# Altium project Clock.PrjPCB
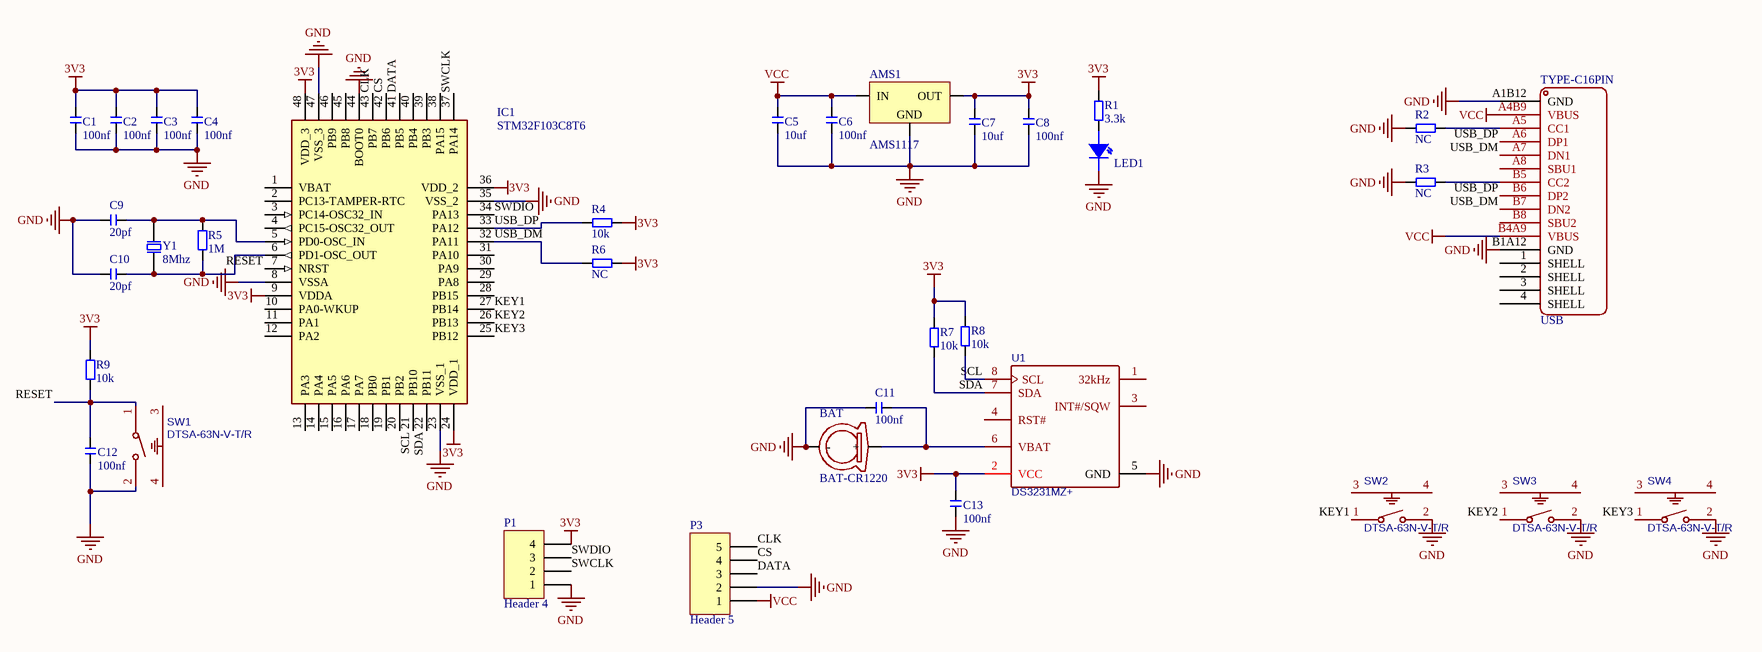
[diagram p0: Clocl.SchDoc]
1 sheet, 35 parts. Net scope: global (net labels, ports and power ports of the same name join across sheets).
Board file: Clock.PcbDoc

## Sheet Clocl.SchDoc
size A3

### Parts
AMS1  AMS1117  [SOT223]
BAT  BAT-CR1220  [BAT-CR1220]
C1  100nf  [C0805]
C2  100nf  [C0805]
C3  100nf  [C0805]
C4  100nf  [C0805]
C5  10uf  [C0805]
C6  100nf  [C0805]
C7  10uf  [C0805]
C8  100nf  [C0805]
C9  20pf  [C0805]
C10  20pf  [C0805]
C11  100nf  [C0805]
C12  100nf  [C0805]
C13  100nf  [C0805]
IC1  STM32F103C8T6  [QFP50P900X900X160-48N]
LED1  LED  [LED0603-Orange]  (value not drawn)
P1  Header 4  [HDR1X4]
P3  Header 5  [HDR1X5]
R1  3.3k  [R0805]
R2  NC  [R0805]
R3  NC  [R0805]
R4  10k  [R0805]
R5  1M  [R0805]
R6  NC  [R0805]
R7  10k  [R0805]
R8  10k  [R0805]
R9  10k  [R0805]
SW1  DTSA-63N-V-T/R  [SW-TH_DTSA-63N-V-T/R]
SW2  DTSA-63N-V-T/R  [SW-TH_DTSA-63N-V-T/R]
SW3  DTSA-63N-V-T/R  [SW-TH_DTSA-63N-V-T/R]
SW4  DTSA-63N-V-T/R  [SW-TH_DTSA-63N-V-T/R]
TYPE-C16PIN  USB  [USB3.0-TYPE-C-SMD_16PIN-H-PITCH0.50]
U1  DS3231MZ+  [SOIC-8_L4.9-W3.9-P1.27-LS6.0-BL]
Y1  8Mhz  [XTAL_49S-SMD]

### Nets
3V3: AMS1.2(OUT) C1.1 C2.1 C3.1 C4.1 C7.1 C8.1 C13.1 IC1.9(VDDA) IC1.24(VDD_1) IC1.36(VDD_2) IC1.48(VDD_3) P1.4 R1.2 R4.1 R6.1 R7.2 R8.2 R9.2 U1.2(VCC)
GND: AMS1.1(GND) BAT.2(-) C1.2 C2.2 C3.2 C4.2 C5.2 C6.2 C7.2 C8.2 C9.1 C10.1 C11.1 C12.2 C13.2 IC1.8(VSSA) IC1.23(VSS_1) IC1.35(VSS_2) IC1.44(BOOT0) IC1.47(VSS_3) LED1.2 P1.1 P3.2 R2.2 R3.2 SW1.2 SW2.2 SW3.2 SW4.2 TYPE-C16PIN.A1B12(GND) TYPE-C16PIN.B1A12(GND) U1.5(GND)
VCC: AMS1.3(IN) C5.1 C6.1 P3.1 TYPE-C16PIN.A4B9(VBUS) TYPE-C16PIN.B4A9(VBUS)
CLK: IC1.43(PB7) P3.5
CS: IC1.42(PB6) P3.4
DATA: IC1.41(PB5) P3.3
KEY1: IC1.27(PB14) SW2.1
KEY2: IC1.26(PB13) SW3.1
KEY3: IC1.25(PB12) SW4.1
RESET: C12.1 IC1.7(NRST) R9.1 SW1.1
SCL: IC1.21(PB10) R8.1 U1.8(SCL)
SDA: IC1.22(PB11) R7.1 U1.7(SDA)
SWCLK: IC1.37(PA14) P1.2
SWDIO: IC1.34(PA13) P1.3
USB_DM: IC1.32(PA11) R6.2 TYPE-C16PIN.A7(DN1) TYPE-C16PIN.B7(DN2)
USB_DP: IC1.33(PA12) R4.2 TYPE-C16PIN.A6(DP1) TYPE-C16PIN.B6(DP2)
NetBAT_1: BAT.1(+) C11.2 U1.6(VBAT)
NetC9_2: C9.2 IC1.5(PD0-OSC_IN) R5.2 Y1.2
NetC10_2: C10.2 IC1.6(PD1-OSC_OUT) R5.1 Y1.1
NetLED1_1: LED1.1 R1.1
NetR2_1: R2.1 TYPE-C16PIN.A5(CC1)
NetR3_1: R3.1 TYPE-C16PIN.B5(CC2)

Not connected (* = marked no-connect by the designer): IC1 1(VBAT) 2(PC13-TAMPER-RTC) 3(PC14-OSC32_IN) 4(PC15-OSC32_OUT) 10(PA0-WKUP) 11(PA1) 12(PA2) 13(PA3) 14(PA4) 15(PA5) 16(PA6) 17(PA7) 18(PB0) 19(PB1) 20(PB2) 28(PB15) 29(PA8) 30(PA9) 31(PA10) 38(PA15) 39(PB3) 40(PB4) 45(PB8) 46(PB9); SW1 3 4; SW2 3 4; SW3 3 4; SW4 3 4; TYPE-C16PIN 1(SHELL) 2(SHELL) 3(SHELL) 4(SHELL) A8(SBU1) B8(SBU2); U1 1(32kHz) 3(INT#/SQW) 4(RST#)

### Library data of the parts
AMS1 = AMS1117: Power
C1-C13 = CAP: 无极电容; accuracy: 20%
  C1-C4 C6 C8 C11-C13: value: 100nf
  C5 C7: value: 10uf
  C9 C10: value: 20pf
IC1 = STM32F103C8T6: Integrated Circuit; Manufacturer_Name: STMicroelectronics; Allied_Number: 70390993; Datasheet Link: http://www.st.com/st-web-ui/static/active/en/resource/technical/document/datasheet/CD00161566.pdf; Height: 1.6mm; Manufacturer_Part_Number: STM32F103C8T6; Mouser Part Number: 511-STM32F103C8T6; Mouser Price/Stock: https://www.mouser.com/Search/Refine.aspx?Keyword=511-STM32F103C8T6; RS Part Number: 0402279P; RS Price/Stock: http://uk.rs-online.com/web/p/products/0402279P; Allied Price/Stock: http://www.alliedelec.com/stmicroelectronics-stm32f103c8t6/70390993/
LED1 = LED: 发光二极管
P1 = Header 4: Header, 4-Pin; LatestRevisionDate: 17-Jul-2002; LatestRevisionNote: Re-released for DXP Platform.; Publisher: Altium Limited
P3 = Header 5: Header, 5-Pin; LatestRevisionDate: 17-Jul-2002; LatestRevisionNote: Re-released for DXP Platform.; Publisher: Altium Limited
R1-R9 = RES: 电阻
  R1: Value: 3.3k
  R2 R3 R6: Value: NC
  R4 R7-R9: Value: 10k
  R5: Value: 1M
SW1-SW4 = KEY_ASIDE_DTSA-63N-V-T/R: BOM_Manufacturer: Diptronics; Contributor: LCSC; BOM_Supplier: LCSC; BOM_Supplier Part: C483865; BOM_Manufacturer Part: DTSA-63N-V-T/R; spicePre: S; spiceSymbolName: DTSA-63N-V-T/R
TYPE-C16PIN = type-c-16p
U1 = DS3231MZ+: BOM_Manufacturer: MAXIM; SMT Type: Extend; BOM_Supplier: LCSC; BOM_Manufacturer Part: DS3231MZ+; BOM_Supplier Part: C107410; BOM_LCSC Assembly: Yes; spicePre: U; spiceSymbolName: DS3231MZ+
Y1 = XTAL: 无源晶振